# Altium schematic sheet Connectors.SchDoc
size A
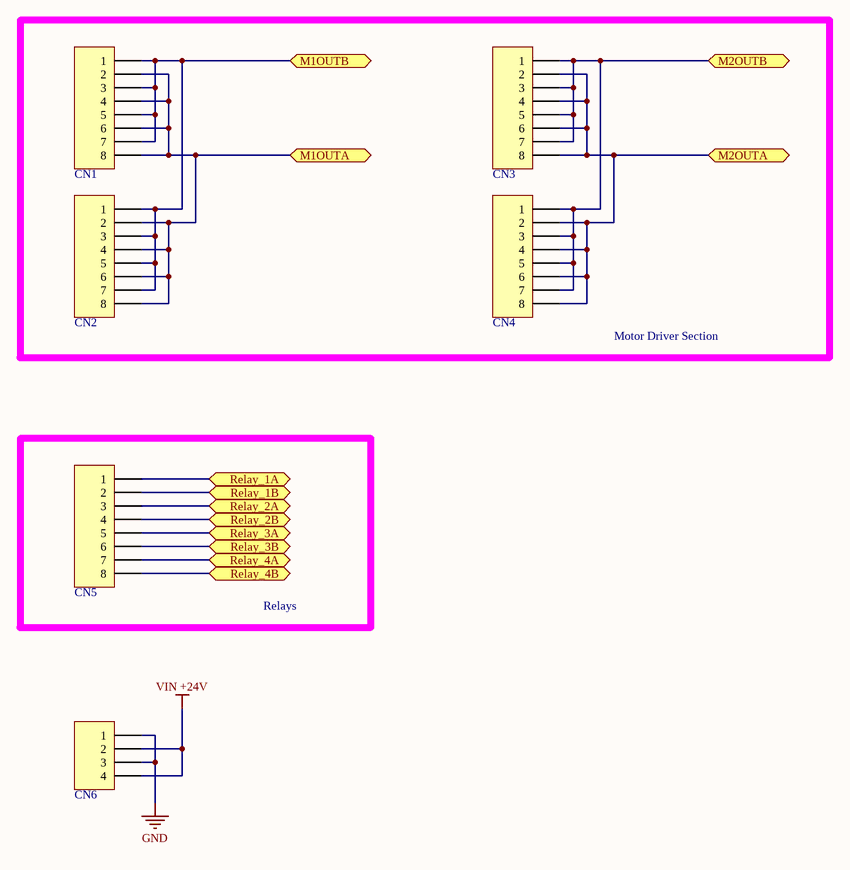
[diagram p0: Connectors.SchDoc]

## Parts
CN1  Connector 4973-08TRNLF  [Connector 4973-08TRNLF]  (value not drawn)
CN2  Connector 4973-08TRNLF  [Connector 4973-08TRNLF]  (value not drawn)
CN3  Connector 4973-08TRNLF  [Connector 4973-08TRNLF]  (value not drawn)
CN4  Connector 4973-08TRNLF  [Connector 4973-08TRNLF]  (value not drawn)
CN5  Connector 4973-08TRNLF  [Connector 4973-08TRNLF]  (value not drawn)
CN6  Connector 4973-04TRNLF  [Connector 4973-04TRNLF]  (value not drawn)

## Blocks framed on the sheet
Motor Driver Section: CN1-CN4
Relays: CN5

## Ports
M1OUTA, M1OUTB, M2OUTA, M2OUTB, Relay_1A (bidir), Relay_1B (bidir), Relay_2A (bidir), Relay_2B (bidir), Relay_3A (bidir), Relay_3B (bidir), Relay_4A (bidir), Relay_4B (bidir)

## Nets
GND: CN6.1 CN6.3
VIN +24V: CN6.2 CN6.4
M1OUTA: CN1.2 CN1.4 CN1.6 CN1.8 CN2.2 CN2.4 CN2.6 CN2.8 ; port M1OUTA
M1OUTB: CN1.1 CN1.3 CN1.5 CN1.7 CN2.1 CN2.3 CN2.5 CN2.7 ; port M1OUTB
M2OUTA: CN3.2 CN3.4 CN3.6 CN3.8 CN4.2 CN4.4 CN4.6 CN4.8 ; port M2OUTA
M2OUTB: CN3.1 CN3.3 CN3.5 CN3.7 CN4.1 CN4.3 CN4.5 CN4.7 ; port M2OUTB
Relay_1A: CN5.1 ; port Relay_1A
Relay_1B: CN5.2 ; port Relay_1B
Relay_2A: CN5.3 ; port Relay_2A
Relay_2B: CN5.4 ; port Relay_2B
Relay_3A: CN5.5 ; port Relay_3A
Relay_3B: CN5.6 ; port Relay_3B
Relay_4A: CN5.7 ; port Relay_4A
Relay_4B: CN5.8 ; port Relay_4B

## Library data of the parts
CN1-CN5 = Connector 4973-08TRNLF: Connector 8-Pin, 90 degree, 3.5mm
CN6 = Connector 4973-04TRNLF: Connector 4-Pin, 90 degree, 3.5mm